# Altium schematic sheet Delay.SchDoc (part 1 of 4)
size C
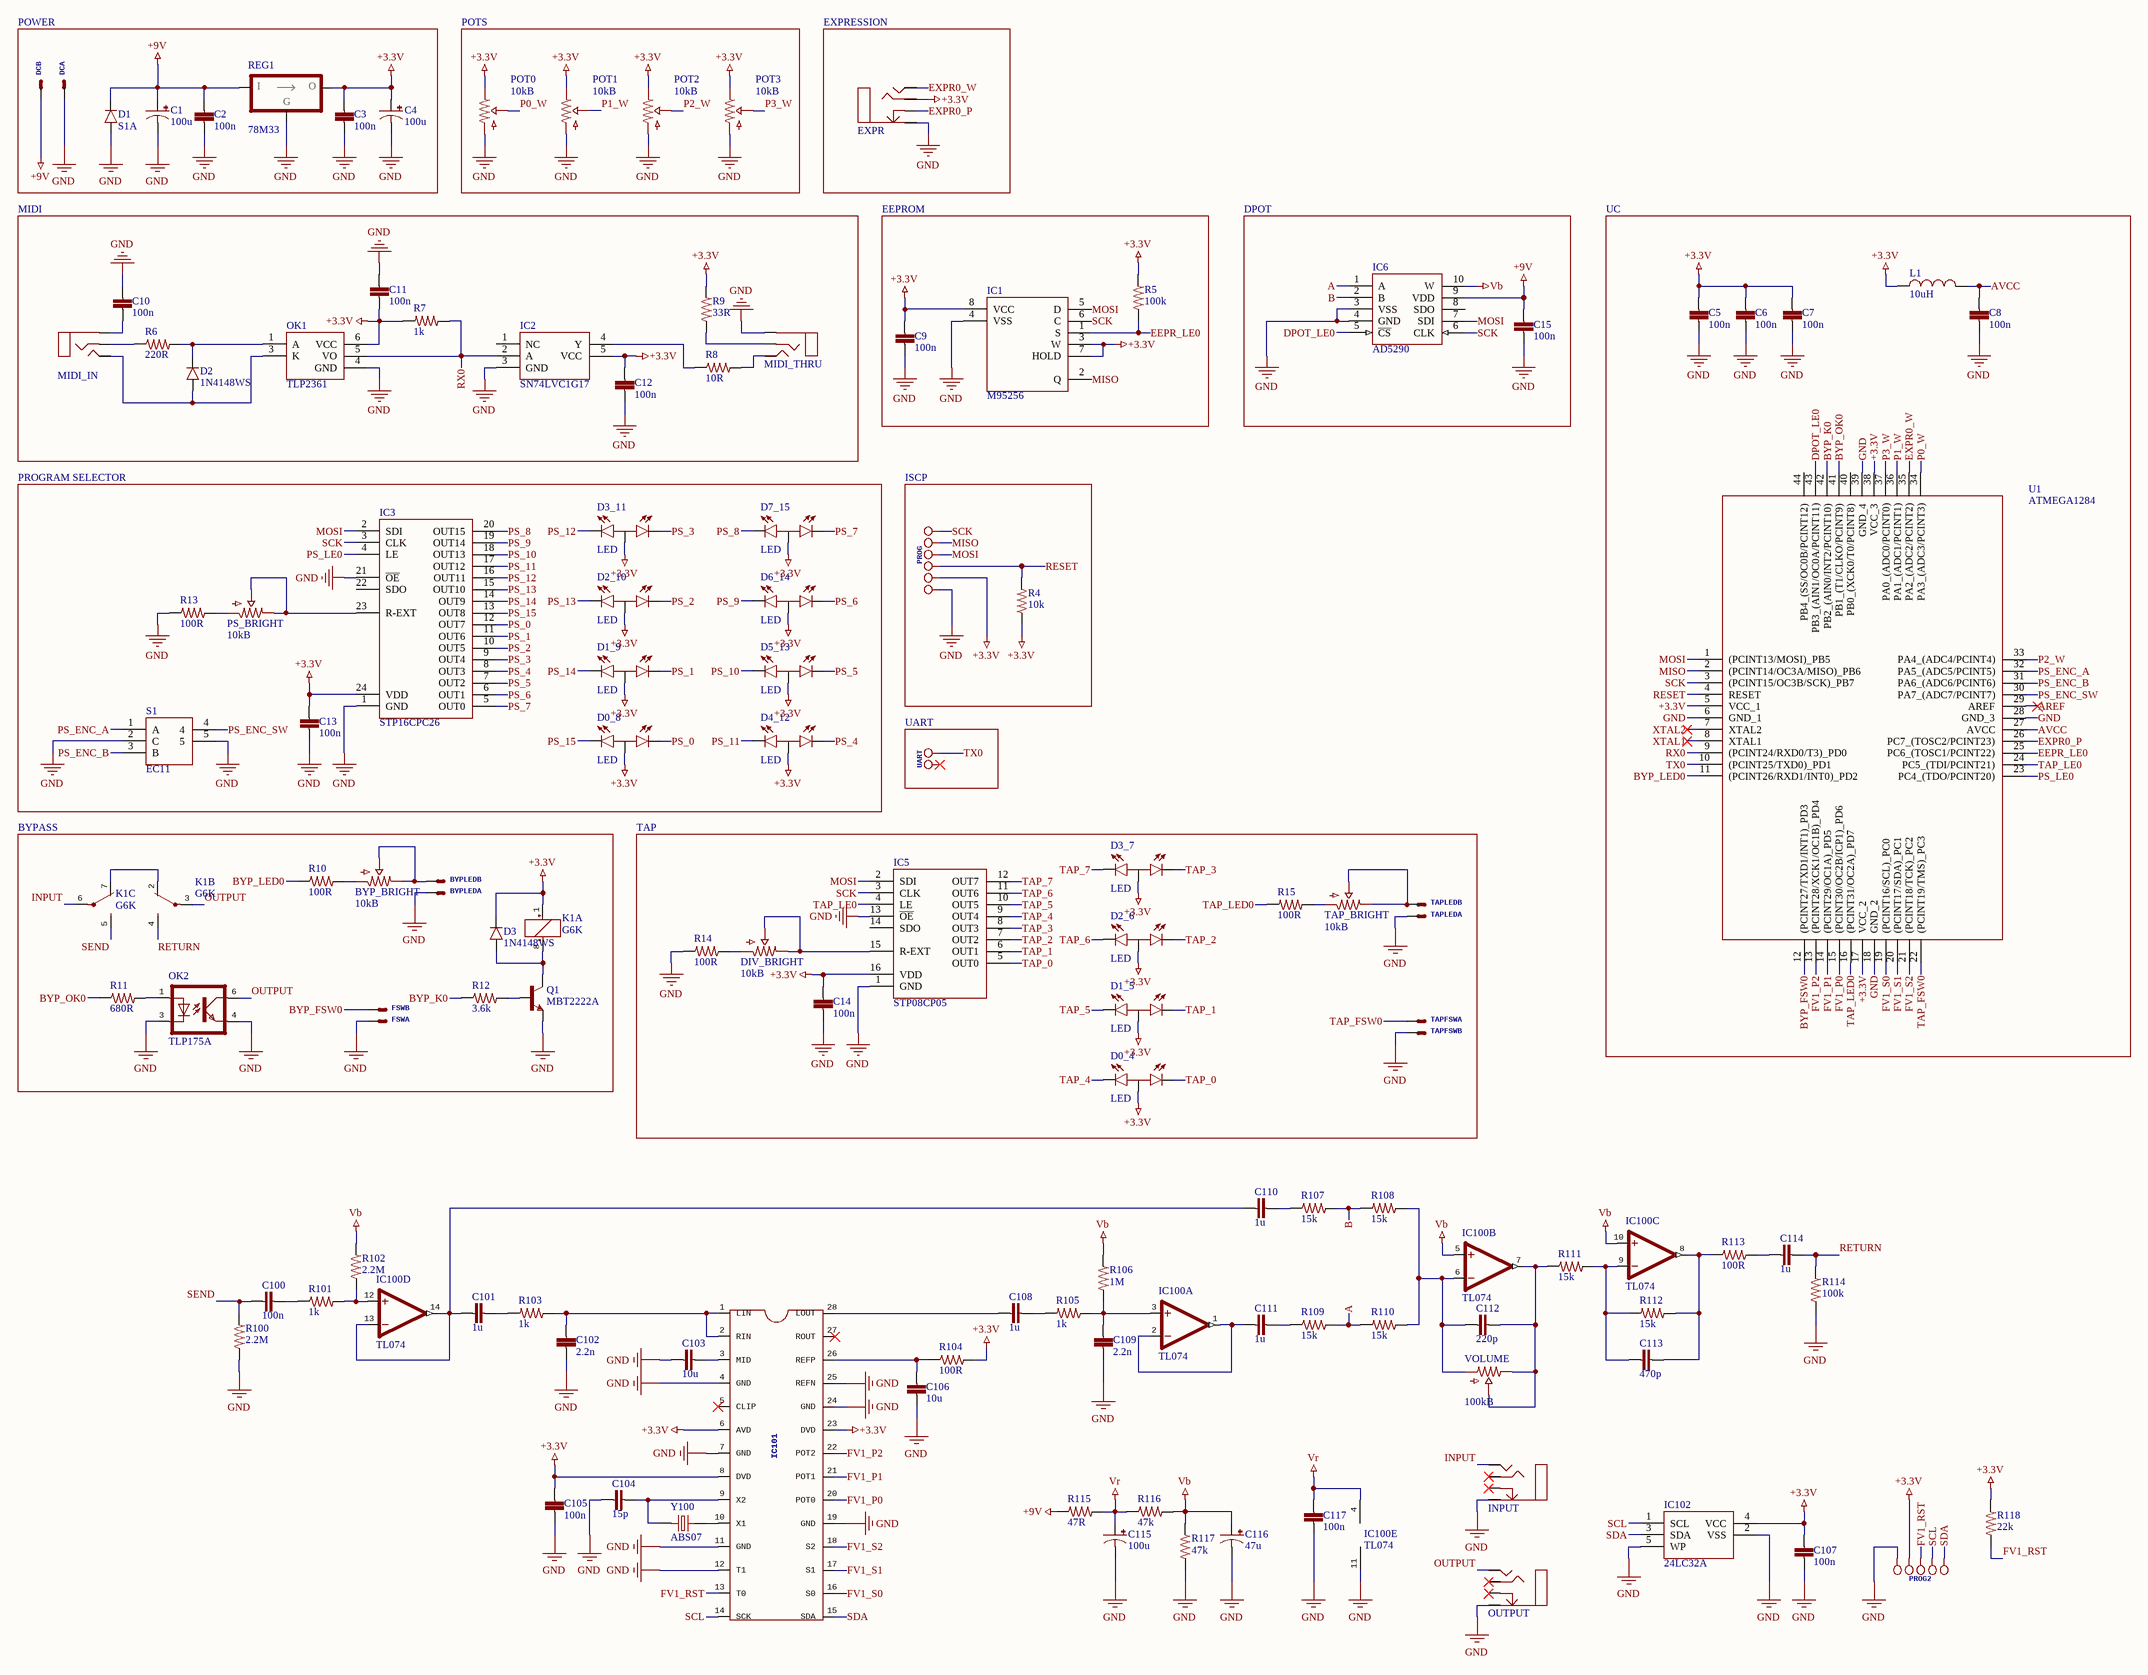
[diagram p0: Delay.SchDoc]

## Parts
BYP_BRIGHT  10kB  [BOURNS_3362P]
BYPLED  (no value)  [JST-XH-02]  (parts A,B of 2)
C1  100u  [CAPAE_D]
C2  100n  [CHIP_0603]
C3  100n  [CHIP_0603]
C4  100u  [CAPAE_D]
C5  100n  [CHIP_0603]
C6  100n  [CHIP_0603]
C7  100n  [CHIP_0603]
C8  100n  [CHIP_0603]
C9  100n  [CHIP_0603]
C10  100n  [CHIP_0603]
C11  100n  [CHIP_0603]
C12  100n  [CHIP_0603]
C13  100n  [CHIP_0603]
C14  100n  [CHIP_0603]
C15  100n  [CHIP_0603]
C100  100n  [CHIP_1206]
C101  1u  [CHIP_1210]
C102  2.2n  [CHIP_0603]
C103  10u  [CHIP_1206]
C104  15p  [CHIP_0603]
C105  100n  [CHIP_0603]
C106  10u  [CHIP_1206]
C107  100n  [CHIP_0603]
C108  1u  [CHIP_1210]
C109  2.2n  [CHIP_0603]
C110  1u  [CHIP_1210]
C111  1u  [CHIP_1210]
C112  220p  [CHIP_0603]
C113  470p  [CHIP_0603]
C114  1u  [CHIP_1210]
C115  100u  [CAPAE_D]
C116  47u  [CAPAE_D]
C117  100n  [CHIP_0603]
D0_4  LED  [LED_3MM_BICOLOR]
D0_8  LED  [LED_3MM_BICOLOR]
D1  S1A  [DO214]
D1_5  LED  [LED_3MM_BICOLOR]
D1_9  LED  [LED_3MM_BICOLOR]
D2  1N4148WS  [SOD323]
D2_6  LED  [LED_3MM_BICOLOR]
D2_10  LED  [LED_3MM_BICOLOR]
D3  1N4148WS  [SOD323]
D3_7  LED  [LED_3MM_BICOLOR]
D3_11  LED  [LED_3MM_BICOLOR]
D4_12  LED  [LED_3MM_BICOLOR]
D5_13  LED  [LED_3MM_BICOLOR]
D6_14  LED  [LED_3MM_BICOLOR]
D7_15  LED  [LED_3MM_BICOLOR]
DC  J_JST-XH-02  [JST-XH-02]  (value not drawn)  (parts A,B of 2)
DIV_BRIGHT  10kB  [BOURNS_3362P]
EXPR  J_STEREO  [STEREO]  (value not drawn)
FSW  (no value)  [JST-XH-02]  (parts A,B of 2)
IC1  M95256  [SO-8]
IC2  SN74LVC1G17  [SOT-23-5]
IC3  STP16CPC26  [SO-24]
IC5  STP08CP05  [SO-16]
IC6  AD5290  [MSOP-10]
IC100  TL074  [SO-14]  (parts A,B,C,D,E of 5)
IC101  FV-1  [SO-28]  (value not drawn)
IC102  24LC32A  [SOT-23-5]
INPUT  J_STEREO  [STEREO]  (value not drawn)
K1  G6K  [G6K]  (parts A,B,C of 3)
L1  10uH  [INDC1608X10]
MIDI_IN  J_STEREO_3.5  [STEREO_3.5]  (value not drawn)
MIDI_THRU  J_STEREO_3.5  [STEREO_3.5]  (value not drawn)
OK1  TLP2361  [TLP2361]
OK2  TLP175A  [TLP175A]
OUTPUT  J_STEREO  [STEREO]  (value not drawn)
POT0  10kB  [ALPHA_9MM_TOP_NOMH]
POT1  10kB  [ALPHA_9MM_TOP_NOMH]
POT2  10kB  [ALPHA_9MM_TOP_NOMH]
POT3  10kB  [ALPHA_9MM_TOP_NOMH]
PROG  J_HEADER_6PINS_FEM  [HEADER_6Pins_FEM]  (value not drawn)
PROG2  J_HEADER_5PINS_FEM  [HEADER_5Pins_FEM]  (value not drawn)
PS_BRIGHT  10kB  [BOURNS_3362P]
Q1  MBT2222A  [SOT323]
R4  10k  [CHIP_R_0603]
R5  100k  [CHIP_R_0603]
R6  220R  [CHIP_R_0603]
R7  1k  [CHIP_R_0603]
R8  10R  [CHIP_R_0603]
R9  33R  [CHIP_R_0603]
R10  100R  [CHIP_R_1206]
R11  680R  [CHIP_R_0603]
R12  3.6k  [CHIP_R_0603]
R13  100R  [CHIP_R_1206]
R14  100R  [CHIP_R_1206]
R15  100R  [CHIP_R_1206]
R100  2.2M  [CHIP_R_0603]
R101  1k  [CHIP_R_0603]
R102  2.2M  [CHIP_R_0603]
R103  1k  [CHIP_R_0603]
R104  100R  [CHIP_R_0603]
R105  1k  [CHIP_R_0603]
R106  1M  [CHIP_R_0603]
R107  15k  [CHIP_R_0603]
R108  15k  [CHIP_R_0603]
R109  15k  [CHIP_R_0603]
R110  15k  [CHIP_R_0603]
R111  15k  [CHIP_R_0603]
R112  15k  [CHIP_R_0603]
R113  100R  [CHIP_R_0603]
R114  100k  [CHIP_R_0603]
R115  47R  [CHIP_R_1206]
R116  47k  [CHIP_R_1206]
R117  47k  [CHIP_R_1206]
R118  22k  [CHIP_R_0603]
REG1  78M33  [SOT223]
S1  EC11  [ALPHA_EC11]
TAP_BRIGHT  10kB  [BOURNS_3362P]
TAPFSW  (no value)  [JST-XH-02]  (parts A,B of 2)
TAPLED  (no value)  [JST-XH-02]  (parts A,B of 2)
U1  ATMEGA1284  [TQFP44]
UART  J_HEADER_2PINS_FEM  [HEADER_2Pins_FEM]  (value not drawn)
VOLUME  100kB  [ALPHA_9MM_TOP_NOMH]
Y100  ABS07  [ABS-07]

## Blocks framed on the sheet
POWER: C1-C4 D1 DC REG1
POTS: POT0-POT3
EXPRESSION: EXPR
MIDI: C10-C12 D2 IC2 MIDI_IN MIDI_THRU OK1 R6-R9
EEPROM: C9 IC1 R5
DPOT: C15 IC6
UC: C5-C8 L1 U1
PROGRAM SELECTOR: C13 D0_8 D1_9 D2_10 D3_11 D4_12 D5_13 D6_14 D7_15 IC3 PS_BRIGHT R13 S1
ISCP: PROG R4
UART: UART
BYPASS: BYP_BRIGHT BYPLED D3 FSW K1 OK2 Q1 R10-R12
TAP: C14 D0_4 D1_5 D2_6 D3_7 DIV_BRIGHT IC5 R14 R15 TAP_BRIGHT TAPFSW TAPLED

## Nets
+3.3V: C3.1 C4.+ C5.1 C6.1 C7.1 C9.2 C11.1 C12.2 C13.1 C14.1 C105.1 C107.1 D0_4.2 D0_8.2 D1_5.2 D1_9.2 D2_6.2 D2_10.2 D3.1 D3_7.2 D3_11.2 D4_12.2 D5_13.2 D6_14.2 D7_15.2 EXPR.R IC1.3(W) IC1.7(HOLD) IC1.8(VCC) IC2.5(VCC) IC3.24(VDD) IC5.16(VDD) IC101.6(AVD) IC101.8(DVD) IC101.23(DVD) IC102.4(VCC) K1.1(+) L1.2 OK1.6(VCC) POT0.3 POT1.3 POT2.3 POT3.3 PROG.5 PROG2.2 R4.2 R5.2 R7.1 R9.2 R104.2 R118.2 REG1.3(OUTPUT) U1.5(VCC_1) U1.17(VCC_2) U1.38(VCC_3)
+9V: C1.+ C2.1 C15.1 D1.1 DC.1(S) IC6.9(VDD) R115.1 REG1.1(INPUT)
GND: BYPLED.2(S) C1.- C2.2 C3.2 C4.- C5.2 C6.2 C7.2 C8.2 C9.1 C10.2 C11.2 C12.1 C13.2 C14.2 C15.2 C102.2 C103.1 C104.2 C105.2 C106.2 C107.2 C109.2 C115.- C116.- C117.2 D1.2 DC.2(S) EXPR.S FSW.2(S) IC1.4(VSS) IC2.3(GND) IC3.1(GND) IC3.21(~{OE}) IC5.1(GND) IC5.13(~{OE}) IC6.3(VSS) IC6.4(GND) IC100.11(V-) IC101.4(GND) IC101.7(GND) IC101.11(GND) IC101.12(T1) IC101.19(GND) IC101.24(GND) IC101.25(REFN) IC102.2(VSS) IC102.5(WP) INPUT.S MIDI_THRU.S OK1.4(GND) OK2.3(C) OK2.4(EMIT) OUTPUT.S POT0.1 POT1.1 POT2.1 POT3.1 PROG.6 PROG2.1 Q1.2(E) R13.1 R14.1 R100.1 R114.1 R117.1 REG1.2(COMMON) S1.2(C) S1.5 TAPFSW.1(S) TAPLED.2(S) U1.6(GND_1) U1.18(GND_2) U1.28(GND_3) U1.39(GND_4)
Vb: C116.+ IC6.10(W) IC100.5(+IN) IC100.10(+IN) R102.2 R106.2 R116.2 R117.2
Vr: C115.+ C117.1 IC100.4(V+) R115.2 R116.1
A: IC6.1(A) R109.2 R110.1
AREF: U1.29(AREF)
AVCC: C8.1 L1.1 U1.27(AVCC)
B: IC6.2(B) R107.2 R108.1
BYP_FSW0: FSW.1(S) U1.12((PCINT27/TXD1/INT1)_PD3)
BYP_K0: R12.1 U1.42(PB2_(AIN0/INT2/PCINT10))
BYP_LED0: R10.1 U1.11((PCINT26/RXD1/INT0)_PD2)
BYP_OK0: R11.1 U1.41(PB1_(T1/CLKO/PCINT9))
DPOT_LE0: IC6.5(~{CS}) U1.43(PB3_(AIN1/OC0A/PCINT11))
EEPR_LE0: IC1.1(S) R5.1 U1.25(PC6_(TOSC1/PCINT22))
EXPR0_P: EXPR.SN U1.26(PC7_(TOSC2/PCINT23))
EXPR0_W: EXPR.T U1.35(PA2_(ADC2/PCINT2))
FV1_P0: IC101.20(POT0) U1.15((PCINT30/OC2B/ICP1)_PD6)
FV1_P1: IC101.21(POT1) U1.14((PCINT29/OC1A)_PD5)
FV1_P2: IC101.22(POT2) U1.13((PCINT28/XCK1/OC1B)_PD4)
FV1_RST: IC101.13(T0) PROG2.3 R118.1
FV1_S0: IC101.16(S0) U1.19((PCINT16/SCL)_PC0)
FV1_S1: IC101.17(S1) U1.20((PCINT17/SDA)_PC1)
FV1_S2: IC101.18(S2) U1.21((PCINT18/TCK)_PC2)
INPUT: INPUT.T K1.6(P)
MISO: IC1.2(Q) PROG.2 U1.2((PCINT14/OC3A/MISO)_PB6)
MOSI: IC1.5(D) IC3.2(SDI) IC5.2(SDI) IC6.7(SDI) PROG.3 U1.1((PCINT13/MOSI)_PB5)
OUTPUT: K1.3(P) OK2.6(COL) OUTPUT.T
P0_W: POT0.2 U1.34(PA3_(ADC3/PCINT3))
P1_W: POT1.2 U1.36(PA1_(ADC1/PCINT1))
P2_W: POT2.2 U1.33(PA4_(ADC4/PCINT4))
P3_W: POT3.2 U1.37(PA0_(ADC0/PCINT0))
PS_0: D0_8.1 IC3.12(OUT7)
PS_1: D1_9.1 IC3.11(OUT6)
PS_2: D2_10.1 IC3.10(OUT5)
PS_3: D3_11.1 IC3.9(OUT4)
PS_4: D4_12.1 IC3.8(OUT3)
PS_5: D5_13.1 IC3.7(OUT2)
PS_6: D6_14.1 IC3.6(OUT1)
PS_7: D7_15.1 IC3.5(OUT0)
PS_8: D7_15.3 IC3.20(OUT15)
PS_9: D6_14.3 IC3.19(OUT14)
PS_10: D5_13.3 IC3.18(OUT13)
PS_11: D4_12.3 IC3.17(OUT12)
PS_12: D3_11.3 IC3.16(OUT11)
PS_13: D2_10.3 IC3.15(OUT10)
PS_14: D1_9.3 IC3.14(OUT9)
PS_15: D0_8.3 IC3.13(OUT8)
PS_ENC_A: S1.1(A) U1.32(PA5_(ADC5/PCINT5))
PS_ENC_B: S1.3(B) U1.31(PA6_(ADC6/PCINT6))
PS_ENC_SW: S1.4 U1.30(PA7_(ADC7/PCINT7))
PS_LE0: IC3.4(LE) U1.23(PC4_(TDO/PCINT20))
RESET: PROG.4 R4.1 U1.4(RESET)
RETURN: C114.1 K1.4(S) R114.2
RX0: IC2.2(A) OK1.5(VO) R7.2 U1.9((PCINT24/RXD0/T3)_PD0)
SCK: IC1.6(C) IC3.3(CLK) IC5.3(CLK) IC6.6(CLK) PROG.1 U1.3((PCINT15/OC3B/SCK)_PB7)
SCL: IC101.14(SCK) IC102.1(SCL) PROG2.4
SDA: IC101.15(SDA) IC102.3(SDA) PROG2.5
SEND: C100.2 K1.5(S) R100.2
TAP_0: D0_4.1 IC5.5(OUT0)
TAP_1: D1_5.1 IC5.6(OUT1)
TAP_2: D2_6.1 IC5.7(OUT2)
TAP_3: D3_7.1 IC5.8(OUT3)
TAP_4: D0_4.3 IC5.9(OUT4)
TAP_5: D1_5.3 IC5.10(OUT5)
TAP_6: D2_6.3 IC5.11(OUT6)
TAP_7: D3_7.3 IC5.12(OUT7)
TAP_FSW0: TAPFSW.2(S) U1.22((PCINT19/TMS)_PC3)
TAP_LE0: IC5.4(LE) U1.24(PC5_(TDI/PCINT21))
TAP_LED0: R15.1 U1.16((PCINT31/OC2A)_PD7)
TX0: U1.10((PCINT25/TXD0)_PD1) UART.1
XTAL1: U1.8(XTAL1)
XTAL2: U1.7(XTAL2)
NetBYP_BRIGHT_1: BYP_BRIGHT.1 R10.2
NetBYP_BRIGHT_2: BYP_BRIGHT.2 BYP_BRIGHT.3 BYPLED.1(S)
NetC10_1: C10.1 MIDI_IN.S
NetC100_1: C100.1 R101.1
NetC101_1: C101.1 R103.1
NetC101_2: C101.2 C110.2 IC100.13(-IN) IC100.14(OUT)
NetC102_1: C102.1 IC101.1(LIN) IC101.2(RIN) R103.2
NetC103_2: C103.2 IC101.3(MID)
NetC104_1: C104.1 IC101.9(X2) Y100.1
NetC106_1: C106.1 IC101.26(REFP) R104.1
NetC108_1: C108.1 R105.1
NetC108_2: C108.2 IC101.28(LOUT)
NetC109_1: C109.1 IC100.3(+IN) R105.2 R106.1
NetC110_1: C110.1 R107.1
NetC111_1: C111.1 R109.1
NetC111_2: C111.2 IC100.1(OUT) IC100.2(-IN)
NetC112_1: C112.1 IC100.7(OUT) R111.1 VOLUME.2 VOLUME.3
NetC112_2: C112.2 IC100.6(-IN) R108.2 R110.2 VOLUME.1
NetC113_1: C113.1 IC100.8(OUT) R112.2 R113.1
NetC113_2: C113.2 IC100.9(-IN) R111.2 R112.1
NetC114_2: C114.2 R113.2
NetD2_1: D2.1 OK1.1(A) R6.2
NetD2_2: D2.2 MIDI_IN.T OK1.3(K)
NetD3_2: D3.2 K1.8(-) Q1.3(C)
NetDIV_BRIGHT_1: DIV_BRIGHT.1 R14.2
NetDIV_BRIGHT_2: DIV_BRIGHT.2 DIV_BRIGHT.3 IC5.15(R-EXT)
NetIC2_4: IC2.4(Y) R8.1
NetIC3_23: IC3.23(R-EXT) PS_BRIGHT.2 PS_BRIGHT.3
NetIC100_12: IC100.12(+IN) R101.2 R102.1
NetIC101_10: IC101.10(X1) Y100.2
NetK1_2: K1.2(O) K1.7(O)
NetMIDI_IN_R: MIDI_IN.R R6.1
NetMIDI_THRU_R: MIDI_THRU.R R9.1
NetMIDI_THRU_T: MIDI_THRU.T R8.2
NetOK2_1: OK2.1(A) R11.2
NetPS_BRIGHT_1: PS_BRIGHT.1 R13.2
NetQ1_1: Q1.1(B) R12.2
NetR15_2: R15.2 TAP_BRIGHT.1
NetTAP_BRIGHT_2: TAP_BRIGHT.2 TAP_BRIGHT.3 TAPLED.1(S)

Not connected (* = marked no-connect by the designer): IC2 1(NC); IC3 22(SDO); IC5 14(SDO); IC6 8(SDO); IC101 5(CLIP)* 27(ROUT)*; INPUT R* SN*; OUTPUT R* SN*; U1 40(PB0_(XCK0/T0/PCINT8)) 44(PB4_(SS/OC0B/PCINT12)); UART 2*